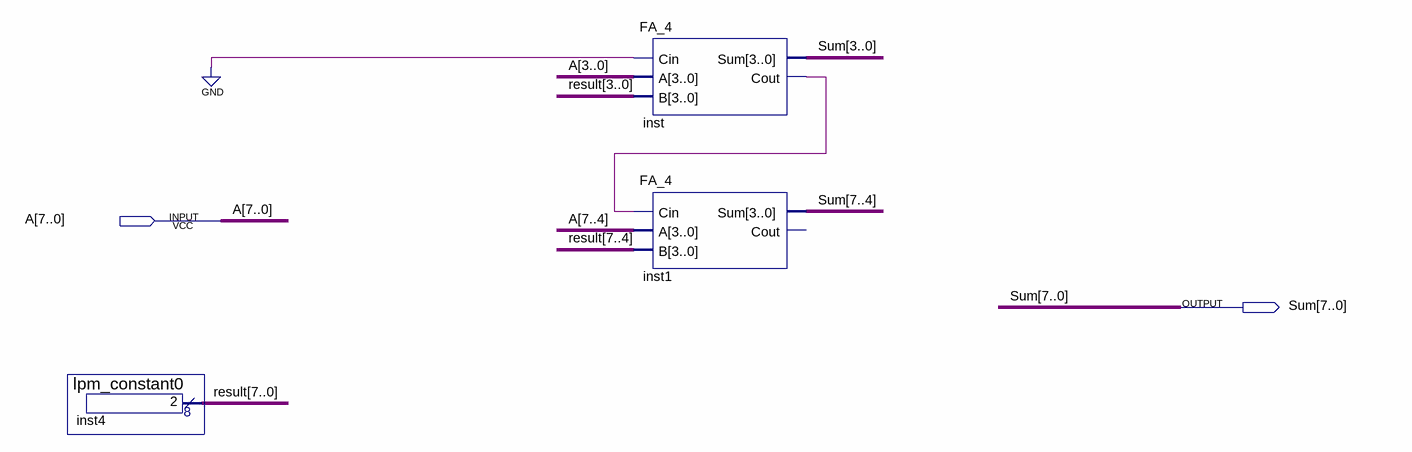
[diagram p0: schematic sheet]
// Quartus schematic PCAdder.bdf as structural Verilog: 3 symbols, 2 pins
module PCAdder (
  input  [7:0] A,
  output [7:0] Sum
);

  wire inst_cout;
  wire [7:0] result;

  lpm_constant0 inst4 (.result(result));
  FA_4 inst (.Cin(1'b0), .A(A[3:0]), .B(result[3:0]), .Sum(Sum[3:0]), .Cout(inst_cout));
  FA_4 inst1 (.Cin(inst_cout), .A(A[7:4]), .B(result[7:4]), .Sum(Sum[7:4]));  // open: Cout
endmodule
